# EAGLE design interfaceROM (EAGLE 7.3.0)
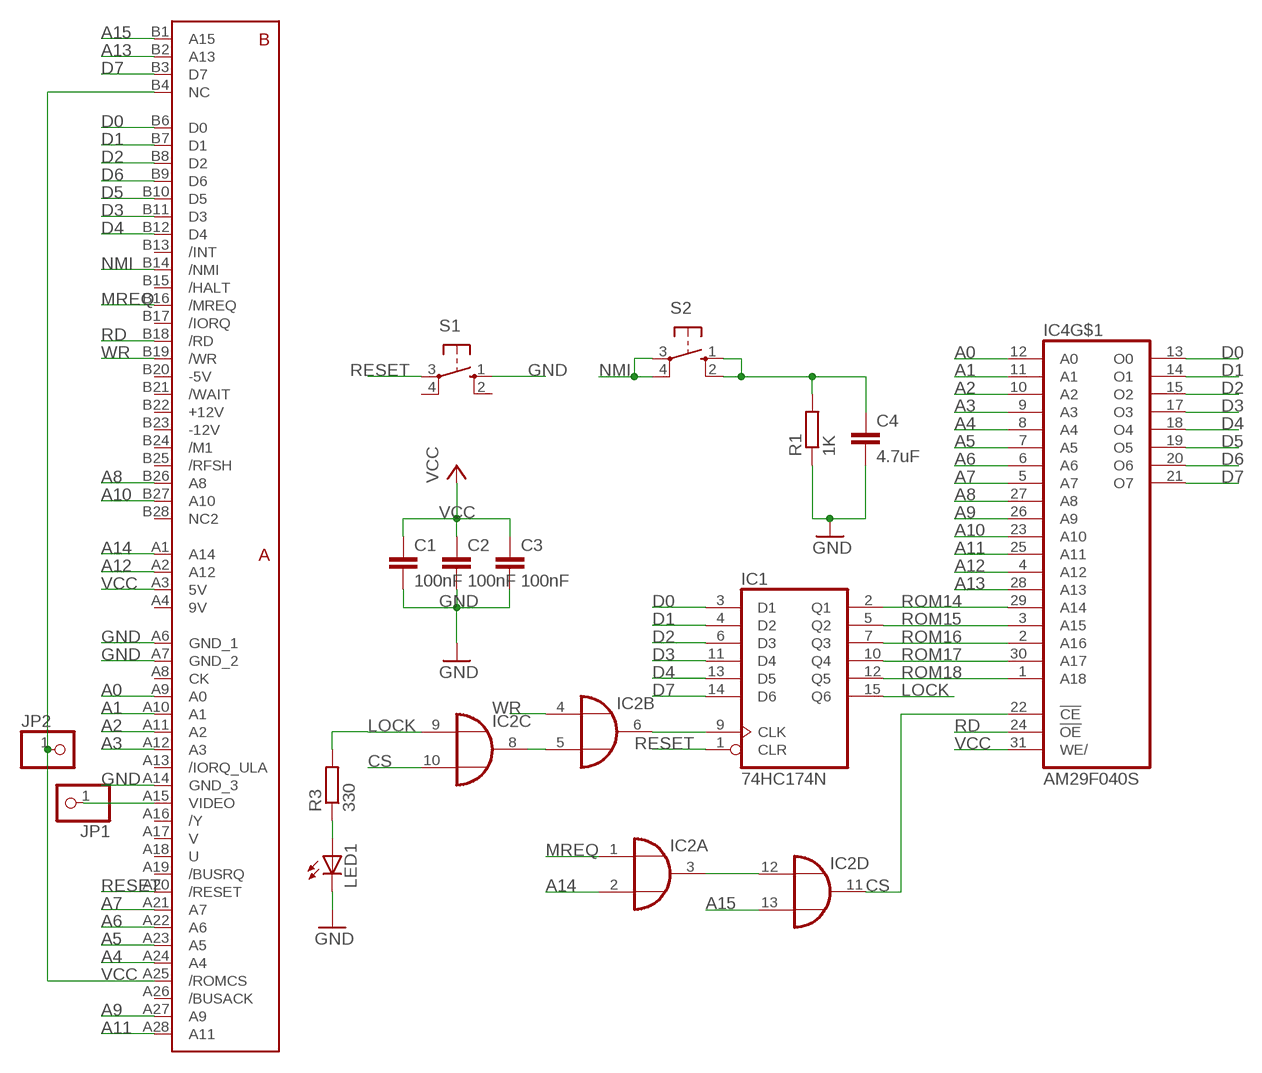
[diagram p0: schematic, sheet 1]

## Parts
C1  100nF  C-EU025-025X050  [C025-025X050]
C2  100nF  C-EU025-025X050  [C025-025X050]
C3  100nF  C-EU025-025X050  [C025-025X050]
C4  4.7uF  C-EU025-025X050  [C025-025X050]
IC1  74HC174N  [DIL16]
IC2  74HC32N  [DIL14]
IC4  AM29F040S  [PLCC-SR32]
JP1  PINHD-1X1  [1X01]
JP2  PINHD-1X1  [1X01]
LED1  LED3MM  [LED3MM]
R1  1K  R-EU_0204/7  [0204/7]
R3  330  R-EU_0204/7  [0204/7]
S1  10-XX  [B3F-10XX]
S2  10-XX  [B3F-10XX]
U$3  ZXSP_ED2X28_SPE  [2X28_SPE]

## Nets
A0: IC4.12(A0) U$3.A9(A0)
A1: IC4.11(A1) U$3.A10(A1)
A2: IC4.10(A2) U$3.A11(A2)
A3: IC4.9(A3) U$3.A12(A3)
A4: IC4.8(A4) U$3.A24(A4)
A5: IC4.7(A5) U$3.A23(A5)
A6: IC4.6(A6) U$3.A22(A6)
A7: IC4.5(A7) U$3.A21(A7)
A8: IC4.27(A8) U$3.B26(A8)
A9: IC4.26(A9) U$3.A27(A9)
A10: IC4.23(A10) U$3.B27(A10)
A11: IC4.25(A11) U$3.A28(A11)
A12: IC4.4(A12) U$3.A2(A12)
A13: IC4.28(A13) U$3.B2(A13)
A14: IC2.2(A:I1) U$3.A1(A14)
A15: IC2.13(D:I1) U$3.B1(A15)
CS: IC2.10(C:I1) IC2.11(D:O) IC4.22(!CE)
D0: IC1.3(D1) IC4.13(O0) U$3.B6(D0)
D1: IC1.4(D2) IC4.14(O1) U$3.B7(D1)
D2: IC1.6(D3) IC4.15(O2) U$3.B8(D2)
D3: IC1.11(D4) IC4.17(O3) U$3.B11(D3)
D4: IC1.13(D5) IC4.18(O4) U$3.B12(D4)
D5: IC4.19(O5) U$3.B10(D5)
D6: IC4.20(O6) U$3.B9(D6)
D7: IC1.14(D6) IC4.21(O7) U$3.B3(D7)
GND: C1.2 C2.2 C3.2 C4.2 LED1.K(C) R1.1 S1.1(S) U$3.A6(GND_1) U$3.A7(GND_2) U$3.A14(GND_3)
LOCK: IC1.15(Q6) IC2.9(C:I0) R3.2
MREQ: IC2.1(A:I0) U$3.B16(/MREQ)
N$1: JP1.1 U$3.A15(VIDEO)
N$2: IC1.9(CLK) IC2.6(B:O)
N$3: IC2.3(A:O) IC2.12(D:I0)
N$4: IC2.5(B:I1) IC2.8(C:O)
N$5: C4.1 R1.2 S2.1(S) S2.2(S1)
N$7: LED1.A R3.1
NMI: S2.3(P) S2.4(P1) U$3.B14(/NMI)
RD: IC4.24(!OE) U$3.B18(/RD)
RESET: IC1.1(CLR) S1.3(P) U$3.A20(/RESET)
ROM14: IC1.2(Q1) IC4.29(A14)
ROM15: IC1.5(Q2) IC4.3(A15)
ROM16: IC1.7(Q3) IC4.2(A16)
ROM17: IC1.10(Q4) IC4.30(A17)
ROM18: IC1.12(Q5) IC4.1(A18)
VCC: C1.1 C2.1 C3.1 IC4.31(WE/) JP2.1 U$3.A3(5V) U$3.A25(/ROMCS) U$3.B4(NC)
WR: IC2.4(B:I0) U$3.B19(/WR)
Unconnected: S1.2(S1) S1.4(P1) U$3.A8(CK) U$3.A13(/IORQ_ULA) U$3.A16(/Y) U$3.A17(V) U$3.A18(U) U$3.A19(/BUSRQ) U$3.A26(/BUSACK) U$3.B13(/INT) U$3.B15(/HALT) U$3.B17(/IORQ) U$3.B21(/WAIT) U$3.B24(/M1) U$3.B25(/RFSH) U$3.B28(NC2)

## Power pins joined to a net without a drawn wire
9V: U$3.A4(9V)
+12V: U$3.B22(+12V)
-5V: U$3.B20(-5V)
-12V: U$3.B23(-12V)
GND: IC1.8(GND) IC2.7(P:GND) IC4.16(GND)
VCC: IC1.16(VCC) IC2.14(P:VCC) IC4.32(VCC)

## Library data of the parts
C1-C3 = rcl:C-EU: CAPACITOR, European symbol
C4 = resistor:C-EU: CAPACITOR, European symbol
IC1 = 74xx-eu:74*174: Hex D type FLIP FLOP, clear
IC2 = 74xx-eu:74*32: Quad 2-input OR gate
IC4 = am29-memory:AM29F040S
JP1 JP2 = pinhead:PINHD-1X1: PIN HEADER
LED1 = led:LED: LED OSRAM: - CHIPLED LG R971, LG N971, LY N971, LG Q971, LY Q971, LO R971, LY R971 LH N974, LH R974 LS Q976, LO Q976, LY Q976 LO Q996 - Hyper CHIPLED LW Q18S LB Q993, LB Q99A, LB R99A - SideLED LS A670, LO A670, LY A670, LG A670, LP A670 LB A673, LV A673, LT A673, LW A673 LH A674 LY A675 LS A676, LA A676, LO A676, LY A676, LW A676 LS A679, LY A679, LG A679 - Hyper Micro SIDELED® LS Y876, LA Y876, LO Y876, LY Y876 LT Y87S - SmartLED LW L88C, LW L88S LB L89C, LB L89S, LG L890 LS L89K, LO L89K, LY L89K LS L896, LA L896, LO L896, LY L896 - TOPLED LS T670, LO T670, LY T670, LG T670, LP T670 LSG T670, LSP T670, LSY T670, LOP T670, LYG T670 LG T671, LOG T671, LSG T671 LB T673, LV T673, LT T673, LW T673 LH T674 LS T676, LA T676, LO T676, LY T676, LB T676, LH T676, LSB T676, LW T676 LB T67C, LV T67C, LT T67C, LS T67K, LO T67K, LY T67K, LW E67C LS E67B, LA E67B, LO E67B, LY E67B, LB E67C, LV E67C, LT E67C LW T67C LS T679, LY T679, LG T679 LS T770, LO T770, LY T770, LG T770, LP T770 LB T773, LV T773, LT T773, LW T773 LH T774 LS E675, LA E675, LY E675, LS T675 LS T776, LA T776, LO T776, LY T776, LB T776 LHGB T686 LT T68C, LB T68C - Hyper Mini TOPLED® LB M676 - Mini TOPLED Santana® LG M470 LS M47K, LO M47K, LY M47K Source: http://www.osram.convergy.de LUXEON: - LUMILED® LXK2-PW12-R00, LXK2-PW12-S00, LXK2-PW14-U00, LXK2-PW14-V00 LXK2-PM12-R00, LXK2-PM12-S00, LXK2-PM14-U00 LXK2-PE12-Q00, LXK2-PE12-R00, LXK2-PE12-S00, LXK2-PE14-T00, LXK2-PE14-U00 LXK2-PB12-K00, LXK2-PB12-L00, LXK2-PB12-M00, LXK2-PB14-N00, LXK2-PB14-P00, LXK2-PB14-Q00 LXK2-PR12-L00, LXK2-PR12-M00, LXK2-PR14-Q00, LXK2-PR14-R00 LXK2-PD12-Q00, LXK2-PD12-R00, LXK2-PD12-S00 LXK2-PH12-R00, LXK2-PH12-S00 LXK2-PL12-P00, LXK2-PL12-Q00, LXK2-PL12-R00 Source: www.luxeon.com KINGBRIGHT: KA-3528ASYC Source: www.kingbright.com
R1 R3 = rcl:R-EU_: RESISTOR, European symbol
S1 S2 = switch-omron:10-XX: OMRON SWITCH; MPN: B3F-1000; OC_FARNELL: 176432; OC_NEWARK: 36M3542
U$3 = zx_edge:ZXSP_ED

## Board
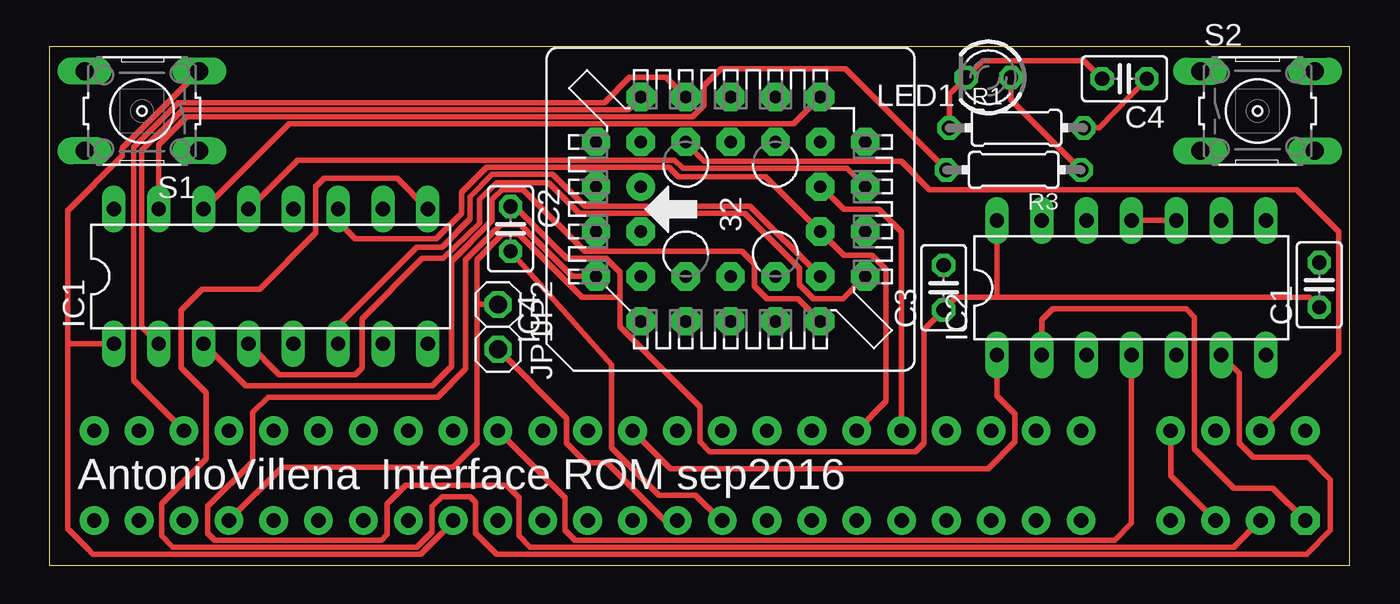
[diagram p1: board, top side]
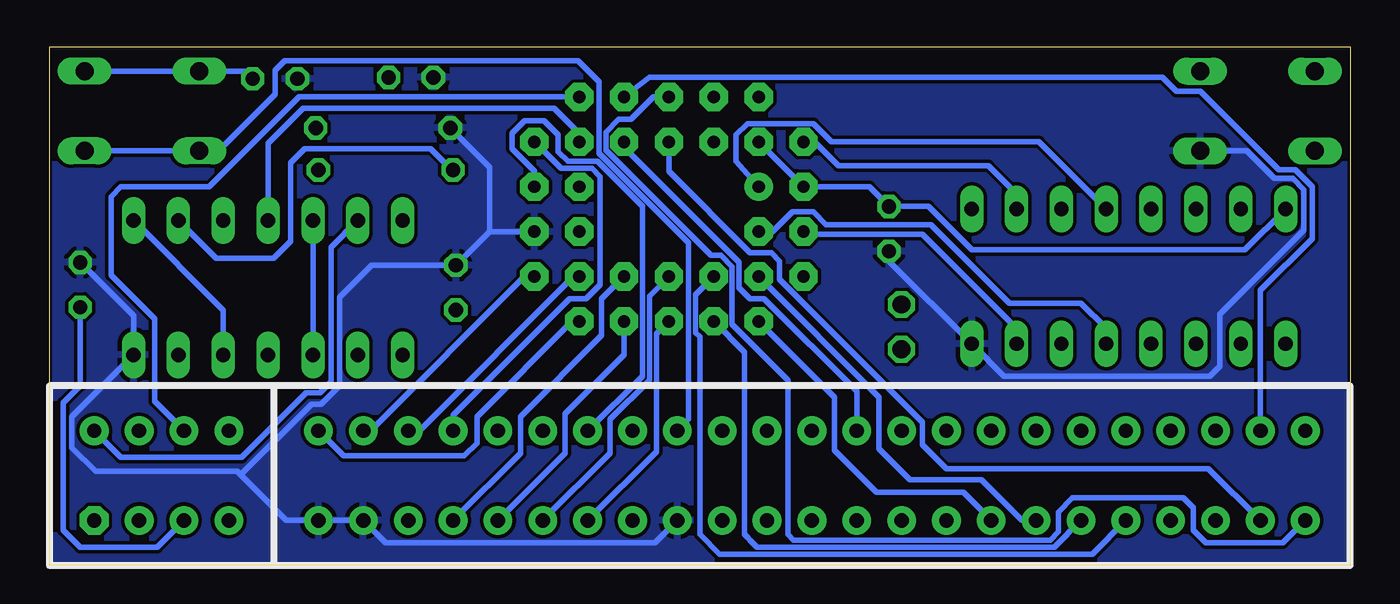
[diagram p2: board, bottom side, seen from below]

No outline drawn. Coordinates in mm, seen from the top.
Copper layers (1*16): Top 0.035mm / dielectric 1.5mm / Bottom 0.035mm
Design rules "default": minimum track width 10mil, minimum drill 24mil, track to track 8mil, track to pad 8mil, pad to pad 8mil, via to via 8mil, smd to smd 8mil, copper to edge 40mil, drill to drill 8mil, minimum pad ring 10mil, minimum via ring 8mil, stop-mask expansion 4mil, vias tented up to drill 0mil, thermal gap 10mil
Milling: 4 lines

### Footprints (pad centres in the part's own frame; a part is rotated, then mirrored left to right if it is on the bottom)
C025-025X050 = drill 0.813 octagon: 1 -1.27,0; 2 1.27,0
DIL16 = drill 0.813 long: 1 -8.89,-3.81; 2 -6.35,-3.81; 3 -3.81,-3.81; 4 -1.27,-3.81; 5 1.27,-3.81; 6 3.81,-3.81; 7 6.35,-3.81; 8 8.89,-3.81; 9 8.89,3.81; 10 6.35,3.81; 11 3.81,3.81; 12 1.27,3.81; 13 -1.27,3.81; 14 -3.81,3.81; 15 -6.35,3.81; 16 -8.89,3.81
DIL14 = drill 0.813 long: 1 -7.62,-3.81; 2 -5.08,-3.81; 3 -2.54,-3.81; 4 0,-3.81; 5 2.54,-3.81; 6 5.08,-3.81; 7 7.62,-3.81; 8 7.62,3.81; 9 5.08,3.81; 10 2.54,3.81; 11 0,3.81; 12 -2.54,3.81; 13 -5.08,3.81; 14 -7.62,3.81
PLCC-SR32 = drill 0.7 pad 1.6: 1 1.27,5.08 | drill 0.7 pad 1.6 octagon: 2 -1.27,7.62; 3 -1.27,5.08; 4 -3.81,7.62; 5 -6.35,5.08; 6 -3.81,5.08; 7 -6.35,2.54; 8 -3.81,2.54; 9 -6.35,0; 10 -3.81,0; 11 -6.35,-2.54; 12 -3.81,-2.54; 13 -6.35,-5.08; 14 -3.81,-7.62; 15 -3.81,-5.08; 16 -1.27,-7.62; 17 -1.27,-5.08; 18 1.27,-7.62; 19 1.27,-5.08; 20 3.81,-7.62; 21 6.35,-5.08; 22 3.81,-5.08; 23 6.35,-2.54; 24 3.81,-2.54; 25 6.35,0; 26 3.81,0; 27 6.35,2.54; 28 3.81,2.54; 29 6.35,5.08; 30 3.81,7.62; 31 3.81,5.08; 32 1.27,7.62
1X01 = drill 1.016 octagon: 1 0,0
LED3MM = drill 0.813 octagon: A -1.27,0; K 1.27,0
0204/7 = drill 0.813 octagon: 1 -3.81,0; 2 3.81,0
B3F-10XX = drill 1.016 long: 1 -3.251,2.261; 2 3.251,2.261; 3 -3.251,-2.261; 4 3.251,-2.261
2X28_SPE = drill 0.813 pad 1.626 octagon: A1 0,-5.08 | drill 0.813 pad 1.626: A2 2.54,-5.08; A3 5.08,-5.08; A4 7.62,-5.08; A6 12.7,-5.08; A7 15.24,-5.08; A8 17.78,-5.08; A9 20.32,-5.08; A10 22.86,-5.08; A11 25.4,-5.08; A12 27.94,-5.08; A13 30.48,-5.08; A14 33.02,-5.08; A15 35.56,-5.08; A16 38.1,-5.08; A17 40.64,-5.08; A18 43.18,-5.08; A19 45.72,-5.08; A20 48.26,-5.08; A21 50.8,-5.08; A22 53.34,-5.08; A23 55.88,-5.08; A24 58.42,-5.08; A25 60.96,-5.08; A26 63.5,-5.08; A27 66.04,-5.08; A28 68.58,-5.08; B1 0,0; B2 2.54,0; B3 5.08,0; B4 7.62,0; B6 12.7,0; B7 15.24,0; B8 17.78,0; B9 20.32,0; B10 22.86,0; B11 25.4,0; B12 27.94,0; B13 30.48,0; B14 33.02,0; B15 35.56,0; B16 38.1,0; B17 40.64,0; B18 43.18,0; B19 45.72,0; B20 48.26,0; B21 50.8,0; B22 53.34,0; B23 55.88,0; B24 58.42,0; B25 60.96,0; B26 63.5,0; B27 66.04,0; B28 68.58,0

### Placement (x,y rotation side)
C1  71.91,15.88 90 top
C2  26.11,19.05 270 top
C3  50.64,15.72 90 top
C4  60.88,27.54 180 top
IC1  12.54,16.35 0 top
IC2  61.28,15.72 0 top
IC4  38.58,20.16 90 top
JP1  25.4,12.22 270 top
JP2  25.4,14.76 270 top
LED1  53.18,27.62 180 top
R1  54.77,24.77 0 top
R3  54.61,22.38 180 top
S1  5.24,25.72 180 top
S2  68.42,25.72 0 top
U$3  71.12,7.62 0 bottom

### Tracks (layer width: path | path; a pad name or v marks a point on that pad's centre or on a via)
A0
  Bottom 0.305: IC4.12 42.39,15.08 42.39,13.02 46.99,8.41 46.99,6.35 U$3.A9
A1
  Bottom 0.305: IC4.11 41.12,11.91 44.45,8.57 44.45,6.35 U$3.A10
A2
  Bottom 0.305: IC4.10 39.69,15.24 39.69,10.48 41.91,8.26 41.91,6.35 U$3.A11
A3
  Bottom 0.305: IC4.9 39.29,13.1 39.29,6.43 U$3.A12
A4
  Bottom 0.305: IC4.8 37.07,15.32 37.07,13.18 36.83,12.94 36.83,1.75 35.72,0.64 14.61,0.64 U$3.A24
A5
  Bottom 0.305: IC4.7 34.29,12.06 34.29,1.75 34.09,1.55 33.97,1.43 33.58,1.03 16.75,1.03 U$3.A23
A6
  Bottom 0.305: U$3.A22 18.57,2.54 20.88,4.84 24.92,4.84 26.67,6.59 26.67,9.53 IC4.6
A7
  Bottom 0.305: IC4.5 29.21,9.53 29.21,6.51 26.83,4.13 21.91,4.13 U$3.A21
A8
  Top 0.305: IC4.27 34.92,27.62 32.86,27.62 31.43,26.19 7.3,26.19 4.76,23.65 4.76,10.48 U$3.B26
A9
  Bottom 0.305: U$3.A27 8.02,5.48 22.86,5.48 24.21,6.83 24.21,8.1 32.31,16.19 32.31,17.22 32.78,17.7 33.97,17.7 38.58,22.3 IC4.26
A10
  Bottom 0.305: U$3.B27 5.08,15.56 2.14,18.49 2.14,21.43 3.1,22.38 4.05,22.38 8.49,26.83 9.84,26.83 10.64,27.62 39.69,27.62 IC4.23
A11
  Bottom 0.305: U$3.A28 3.81,1.27 8.18,1.27 8.89,1.98 8.89,3.25 9.45,3.81 15.72,3.81 16.51,3.02 16.51,1.91 16.99,1.43 31.51,1.43 31.83,1.75 31.83,10.48 35,13.65 35,16.91 35.64,17.54 36.2,17.54 42.15,23.5 42.15,24.53 41.43,25.24 40.72,25.24 39.45,26.51 IC4.25
A12
  Top 0.305: U$3.A2 67.07,1.03 27.23,1.03 26.59,1.67 26.59,3.81 25.88,4.52 20.16,4.52 19.13,3.49 19.13,1.75 18.81,1.43 9.37,1.43 8.97,1.83 8.97,3.33 11.51,5.87 11.51,8.65 12.38,9.53 21.99,9.53 23.57,11.11 23.57,17.3 25.56,19.29 26.67,19.29 29.61,16.35 IC4.4
A13
  Top 0.305: IC4.28 36.04,23.89 37.07,22.86 48.26,22.86 49.85,21.27 70.64,21.27 73.03,18.89 73.03,12.06 U$3.B2
A14
  Top 0.305: IC2.2 56.2,13.89 56.83,14.53 64.37,14.53 64.85,14.05 64.85,6.59 67.07,4.37 69.29,4.37 U$3.A1
A15
  Bottom 0.305: IC2.13 57.71,18.02 57.71,10.4 58.34,9.76 59.13,9.76 62.79,6.11 69.61,6.11 U$3.B1
CS
  Top 0.305: IC2.10 IC2.11
  Bottom 0.305: IC4.22 43.66,24.45 45.09,25.88 59.29,25.88 61.28,23.89 IC2.11
D0
  Top 0.305: IC1.3 11.11,10.16 21.67,10.16 22.78,11.27 22.78,17.22 25.08,19.53 25.08,20.72 25.64,21.27 26.83,21.27 30.32,17.78 39.21,17.78 39.93,17.07 39.93,15.8 40.64,15.08 42.39,15.08 IC4.13
  Bottom 0.305: IC4.13 44.05,13.81 49.45,8.41 49.45,6.91 50.16,6.19 56.99,6.19 U$3.B6
D1
  Top 0.305: IC1.4 13.02,10.79 17.3,10.79 17.7,11.19 17.7,13.97 21.11,17.38 22.3,17.38 24.37,19.37 24.37,20.72 25.32,21.67 28.26,21.67 30,19.92 39.37,19.92 42.47,16.83 42.47,15.88 43.26,15.08 44.93,15.08 IC4.14
  Bottom 0.305: IC4.14 46.75,16.35 55.48,7.62 U$3.B7
D2
  Top 0.305: IC1.6 16.35,13.57 20.8,18.02 22.23,18.02 23.81,19.61 23.81,20.88 25.08,22.15 28.5,22.15 30.32,20.32 39.69,20.32 IC4.15
  Bottom 0.305: IC4.15 43.97,16.35 52.7,7.62 U$3.B8
D3
  Top 0.305: IC1.11 16.35,19.45 17.3,18.49 21.91,18.49 23.34,19.92 23.34,21.11 24.77,22.54 35.08,22.54 35.64,21.99 40.56,21.99 IC4.17 45.01,17.54 46.59,17.54 47.39,16.75 47.39,9.29 U$3.B11
D4
  Top 0.305: IC1.13 14.05,22.94 35.4,22.94 35.88,22.46 45.16,22.46 IC4.18
  Bottom 0.305: IC4.18 46.2,22.3 47.47,23.57 47.47,24.45 46.75,25.16 45.64,25.16 44.85,24.37 44.85,23.42 44.29,22.86 42.62,22.86 40.08,20.32 40.08,10.72 U$3.B12
D5
  Top 0.305: IC4.19 43.74,21.43 45.01,20.16 46.99,20.16 48.26,18.89 U$3.B10
D6
  Bottom 0.305: U$3.B9 50.8,8.49 44.21,15.08 43.26,15.08 42.47,15.88 42.47,21.99 42.94,22.46 44.69,22.46 IC4.20
D7
  Top 0.305: IC4.21 42.15,25 13.57,25 IC1.14
  Bottom 0.305: IC4.21 59.53,26.51 64.61,21.43 69.61,21.43 70.17,20.88 70.17,16.43 67.71,13.97 67.71,9.29 U$3.B3
GND
  Top 0.305: U$3.A14 38.02,2.54 36.59,3.97 34.53,3.97 31.83,6.67 31.83,11.35 C2.2 | R1.1 50.96,26.67 LED1.K 52.86,28.57 58.58,28.57 C4.2
  Bottom 0.305: U$3.A14 39.37,1.27 54.61,1.27 U$3.A7 U$3.A6 60.25,2.54 62.83,5.12 | S1.1 5.84,23.46 4.29,21.91 3.25,21.91 2.62,21.27 2.62,18.97 7.38,14.21 7.38,11.27 7.94,10.72 19.61,10.72 IC1.8 26.11,17.22 C2.2 | C1.2 68.9,14.13 IC2.7 72.39,8.41 72.39,6.67 71.04,5.32 63.02,5.32 62.83,5.12 | IC4.16 48.74,18.89 | 48.74,18.89 C3.2 55.4,16.99 57.23,15.16 57.23,10.16 58.26,9.13 58.82,9.13 62.83,5.12 | 48.74,18.89 48.74,22.54 R1.1
  pour Bottom: 0.32,29.05 73.34,29.05 73.34,0.32 0.32,0.32
LOCK
  Top 0.305: IC1.15 6.19,23.81 7.78,25.4 36.43,25.4 37.07,26.04 37.07,27.15 38.02,28.1 45.09,28.1 R3.2
  Bottom 0.305: R3.2 50.88,22.38 52.07,23.57 59.21,23.57 60.01,22.78 60.01,18.34 60.96,17.38 64.21,17.38 IC2.9
MREQ
  Top 0.305: U$3.B16 35.16,5.48 53.18,5.48 54.69,6.99 54.69,8.57 53.66,9.6 IC2.1
N$1
  Top 0.305: U$3.A15 34.85,2.54 31.59,5.79 30.4,5.79 29.29,6.91 29.29,8.33 JP1.1
N$2
  Top 0.305: IC2.6 67.39,10.87 67.39,6.91 68.18,6.11 71.28,6.11 72.55,4.84 72.55,1.98 71.2,0.64 25.32,0.64 24.13,1.83 24.13,3.57 23.81,3.89 22.23,3.89 21.67,3.33 21.67,1.91 20.8,1.03 6.99,1.03 6.35,1.67 6.35,3.49 8.89,6.03 8.89,9.76 7.46,11.19 7.46,14.45 8.65,15.64 11.91,15.64 15.08,18.81 15.08,21.43 15.56,21.91 19.68,21.91 IC1.9
N$3
  Bottom 0.305: IC2.3 IC2.12
N$4
  Bottom 0.305: IC2.5 63.82,14.45 IC2.8
N$5
  Top 0.305: R1.2 59.45,24.77 C4.1
  Bottom 0.305: C4.1 62.59,27.98 S2.1 S2.2
N$7
  Top 0.305: LED1.A 54.45,26.35 R3.1
NMI
  Bottom 0.305: U$3.B14 37.47,8.26 37.47,18.26 42.55,23.34 42.55,27.38 43.74,28.57 60.33,28.57 60.88,28.02 60.88,26.67 64.14,23.42 65.13,23.42 S2.3 S2.4
RD
  Bottom 0.305: U$3.B18 27.94,9.84 33.18,15.08 33.97,15.08 34.61,15.72 34.61,17.14 41.12,23.65 IC4.24
RESET
  Top 0.305: S1.3 4.13,23.62 4.13,23.18 1.03,20.08 1.03,12.7 | U$3.A20 22.86,2.46 21.03,0.64 2.46,0.64 2.22,0.87 1.75,1.35 1.03,2.06 1.03,12.7 | IC1.1 1.19,12.54 1.03,12.7
ROM14
  Top 0.305: IC1.2 5.24,13.49 5.24,23.5 7.54,25.8 32.78,25.8 IC4.29
ROM15
  Bottom 0.305: IC4.3 32.7,18.89 31.59,20 30.4,20 29.69,19.29 23.73,19.29 19.29,14.84 15.24,14.84 13.81,13.41 IC1.5
ROM16
  Bottom 0.305: IC1.7 18.89,13.41 24.21,18.73 30.8,18.73 IC4.2
ROM17
  Bottom 0.305: IC4.30 30.32,23.97 28.97,22.62 20.48,22.62 18.89,21.03 IC1.10
ROM18
  Bottom 0.305: IC4.1 34.77,22.86 34.77,24.37 34.13,25 30.4,25 29.37,23.97 17.62,23.97 IC1.12
VCC
  Top 0.305: C1.1 71.36,15.16 53.66,15.16 | 53.66,15.16 51.36,15.16 C3.1 49.53,13.34 49.53,6.91 49.05,6.43 37.39,6.43 36.83,6.99 36.83,8.97 32.31,13.49 32.31,15.16 | IC2.14 53.66,15.16 | 32.31,15.16 32.31,16.59 31.51,17.38 29.29,17.38 26.35,20.32 C2.1 | U$3.A25 13.18,5.56 22.86,5.56 24.21,6.91 24.21,14.84 | 24.21,14.84 24.21,17.3 25.64,18.73 26.59,18.73 30.16,15.16 32.31,15.16 | JP2.1 24.29,14.76 24.21,14.84 | U$3.B4 63.5,5.08 U$3.A3
  Bottom 0.305: C1.1 71.91,10.16 72.87,9.21 72.87,1.98 71.91,1.03 67.55,1.03 U$3.A3 | IC1.16 5.95,17.86 21.43,17.86 23.89,20.32 C2.1 27.23,21.43 IC4.32 IC4.31
WR
  Top 0.305: IC2.4 61.28,2.38 60.33,1.43 29.77,1.43 29.21,1.98 29.21,3.81 U$3.B19

### Text on the board
tPlace: AntonioVillena | Interface ROM sep2016